# Altium schematic sheet DAC.SchDoc
size A4; CompanyName: WEITI ISE; Address1: ul. Nowowiejska 15/19; Address2: 00-665 Warszawa; DocumentNumber: 6; SheetNumber: 6; SheetTotal: 7
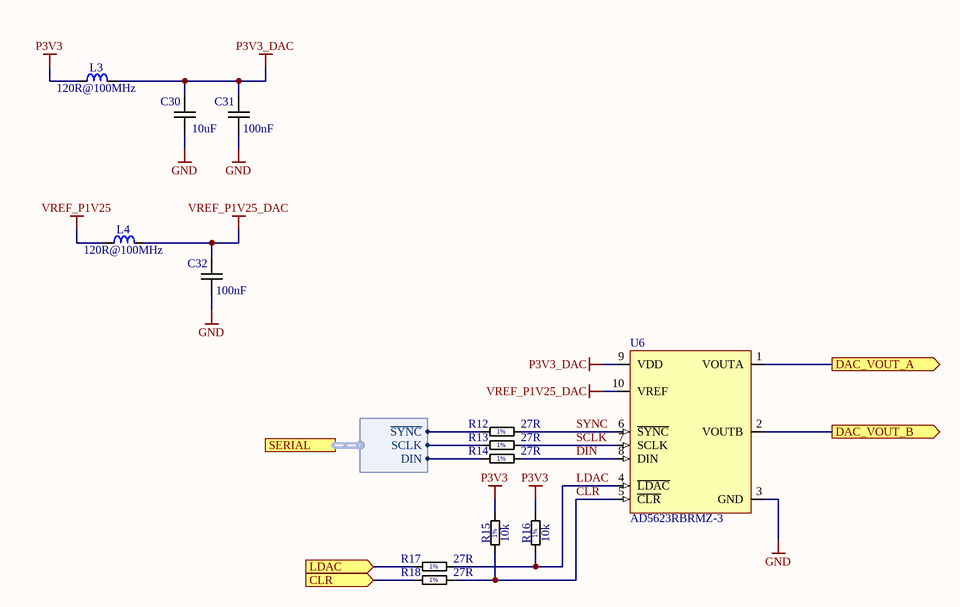
[diagram p0: DAC.SchDoc]

## Parts
C30  10uF  [CAPC0603X90N]
C31  100nF  [CAPC0603X90N]
C32  100nF  [CAPC0603X90N]
L3  120R@100MHz  [INDC0603X90N]
L4  120R@100MHz  [INDC0603X90N]
R12  27R  [RESC0603X60N]
R13  27R  [RESC0603X60N]
R14  27R  [RESC0603X60N]
R15  10k  [RESC0603X60N]
R16  10k  [RESC0603X60N]
R17  27R  [RESC0603X60N]
R18  27R  [RESC0603X60N]
U6  AD5623RBRMZ-3

## Ports
CLR (in), DAC_VOUT_A (out), DAC_VOUT_B (out), LDAC (in), SERIAL (harness SERIAL_DAC)

## Harnesses
SERIAL_DAC: DIN, SCLK, ~{SYNC}

## Nets
GND: C30.2 C31.2 C32.2 U6.3(GND)
P3V3: L3.1 R15.2 R16.2
P3V3_DAC: C30.1 C31.1 L3.2 U6.9(VDD)
VREF_P1V25: L4.1
VREF_P1V25_DAC: C32.1 L4.2 U6.10(VREF)
CLR: R15.1 R18.2 U6.5(~{CLR})
CLR: R18.1 ; port CLR  [a separate net that carries the same name]
DAC_VOUT_A: U6.1(VOUTA) ; port DAC_VOUT_A
DAC_VOUT_B: U6.2(VOUTB) ; port DAC_VOUT_B
DIN: R14.2 U6.8(DIN)
LDAC: R16.1 R17.2 U6.4(~{LDAC})
LDAC: R17.1 ; port LDAC  [a separate net that carries the same name]
SCLK: R13.2 U6.7(SCLK)
SYNC: R12.2 U6.6(~{SYNC})
NetR12_1: R12.1 ; port SERIAL.~{SYNC}
NetR13_1: R13.1 ; port SERIAL.SCLK
NetR14_1: R14.1 ; port SERIAL.DIN

## Notes on the sheet
- Project:
- Title
- File:
- Drawn by:
- Engineer:
- Checked by:
- Szymon Jedliński
- Sheet:
- Revision:
- Total Sheet:
- 1.0
- Variant:
- Approved by:
- Date:

## Library data of the parts
C30 = CC0603_10UF_25V_10%_X7R: Non-polarised capacitor; Manufacturer Part Number: GRM188R61E106KA73D; DesignItemId: CC0603_10UF_25V_10%_X7R; HelpURL: https://www.mouser.pl/datasheet/2/281/1/GRM188R61E106KA73_01A-1985831.pdf; Height: 0.8mm; SMD: Yes; Value: 10uF
C31 C32 = CC0603_100NF_16V_10%_X7R: Non-polarised capacitor; Manufacturer Part Number: VJ0603Y104KXJCW1BC; DesignItemId: CC0603_100NF_16V_10%_X7R; HelpURL: https://www.vishay.com/docs/28548/vjw1bcbascomseries.pdf; Height: 0.8mm; SMD: Yes; Value: 100nF
L3 L4 = FB0603_120R@100MHZ_2A: Ferrite Bead; Manufacturer Part Number: BLM18PG121SN1D; Manufacturer 1 Component Height: 0.8mm; Tolerance: 25%; DesignItemId: FB0603_120R@100MHZ_2A; HelpURL: https://www.tme.eu/Document/19a35c43258593752611d1c31a7dbf1a/MURATA-BLM18P.pdf; SMD: Yes; Value: 120R@100MHz
R12-R14 R17 R18 = R0603_27R_0.1W_100PPM: General Purpose Thick Film Chip Resistor; Manufacturer Part Number: WF06P270JTL; Manufacturer 1 Component Height: 0.5mm; Tolerance: 1%; Voltage: 75V; DesignItemId: R0603_27R_0.1W_100PPM; HelpURL: https://www.vishay.com/docs/20035/dcrcwe3.pdf; SMD: Yes; Value: 27R
R15 R16 = R0603_10K_0.1W_100PPM: General Purpose Thick Film Chip Resistor; Manufacturer Part Number: CQ03SAF1002T5E; Manufacturer 1 Component Height: 0.5mm; Tolerance: 1%; Voltage: 75V; DesignItemId: R0603_10K_0.1W_100PPM; SMD: Yes; Value: 10k
U6 = AD5623RBRMZ-3: AD5623RBRMZ-3, Dual 12-/14-/16-Bit nanoDAC with 5 ppm/°C On-Chip Reference, 10-Pin MSOP; Manufacturer 1 Component Height: 1.1mm; DesignItemId: AD5623RBRMZ-3; Device: AD5623RBRMZ-3; HelpURL: https://www.analog.com/media/en/technical-documentation/data-sheets/AD5623R_43R_63R.pdf; Manufacturer Part Number: AD5623RBRMZ-3; SMD: Yes